# EAGLE board analog-io-breakout (EAGLE 8.3.2)
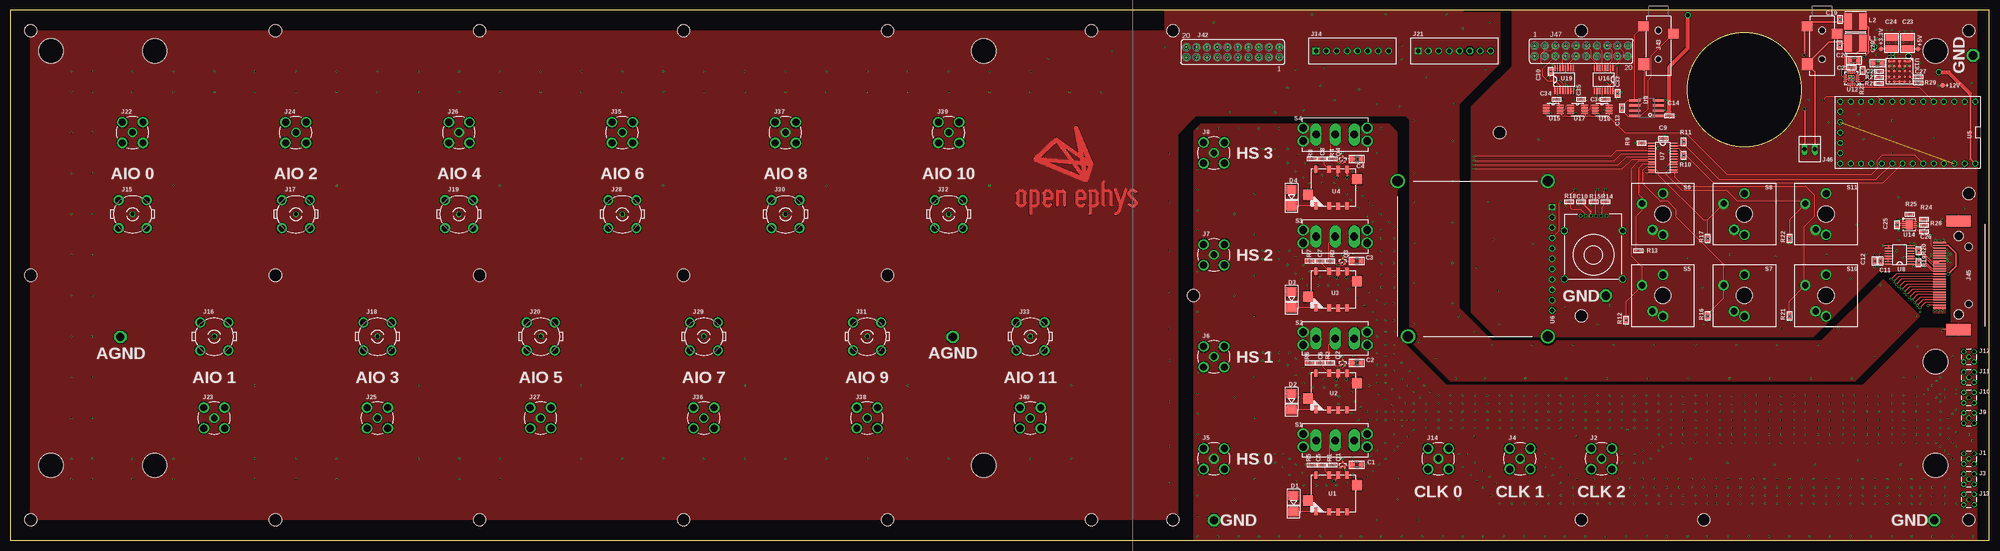
[diagram p5: board, top side]
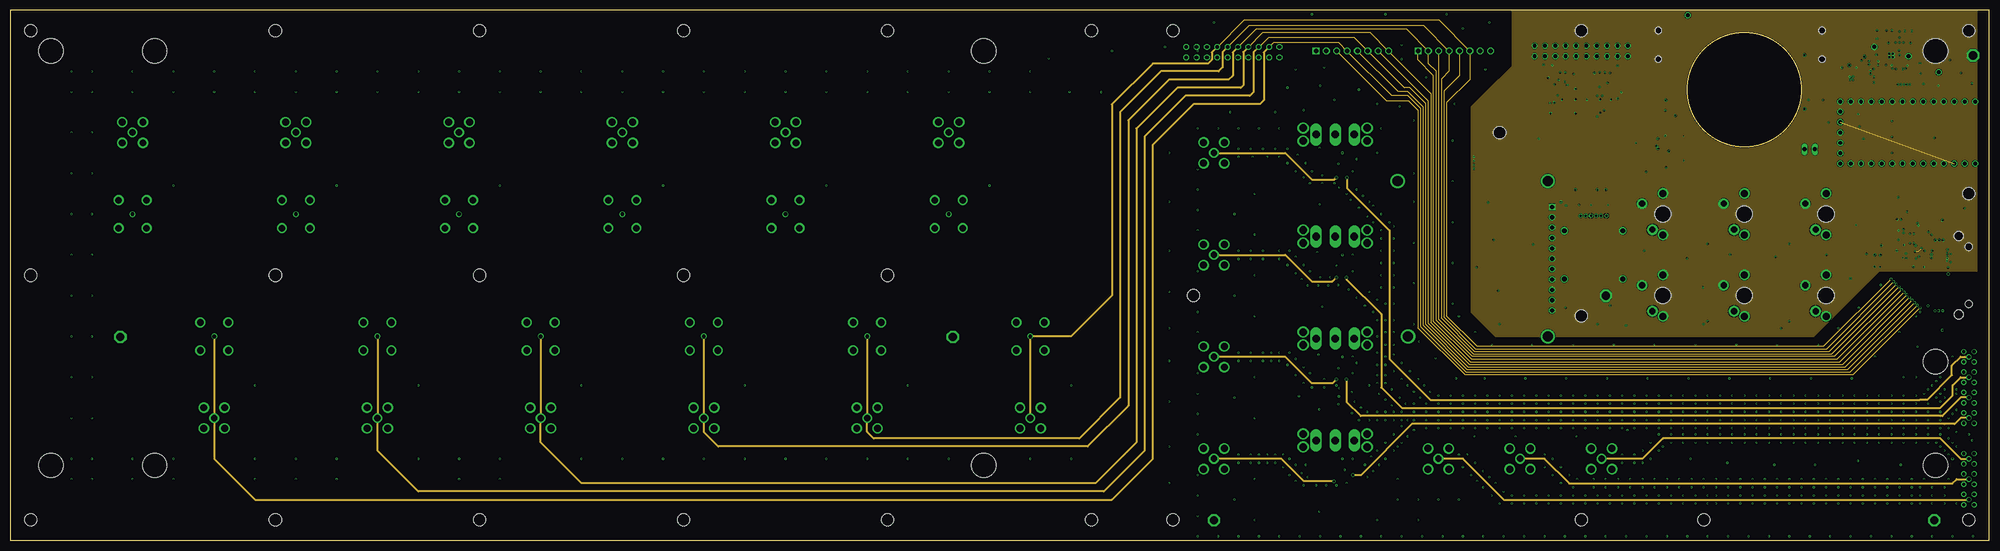
[diagram p6: board, inner layer Route2]
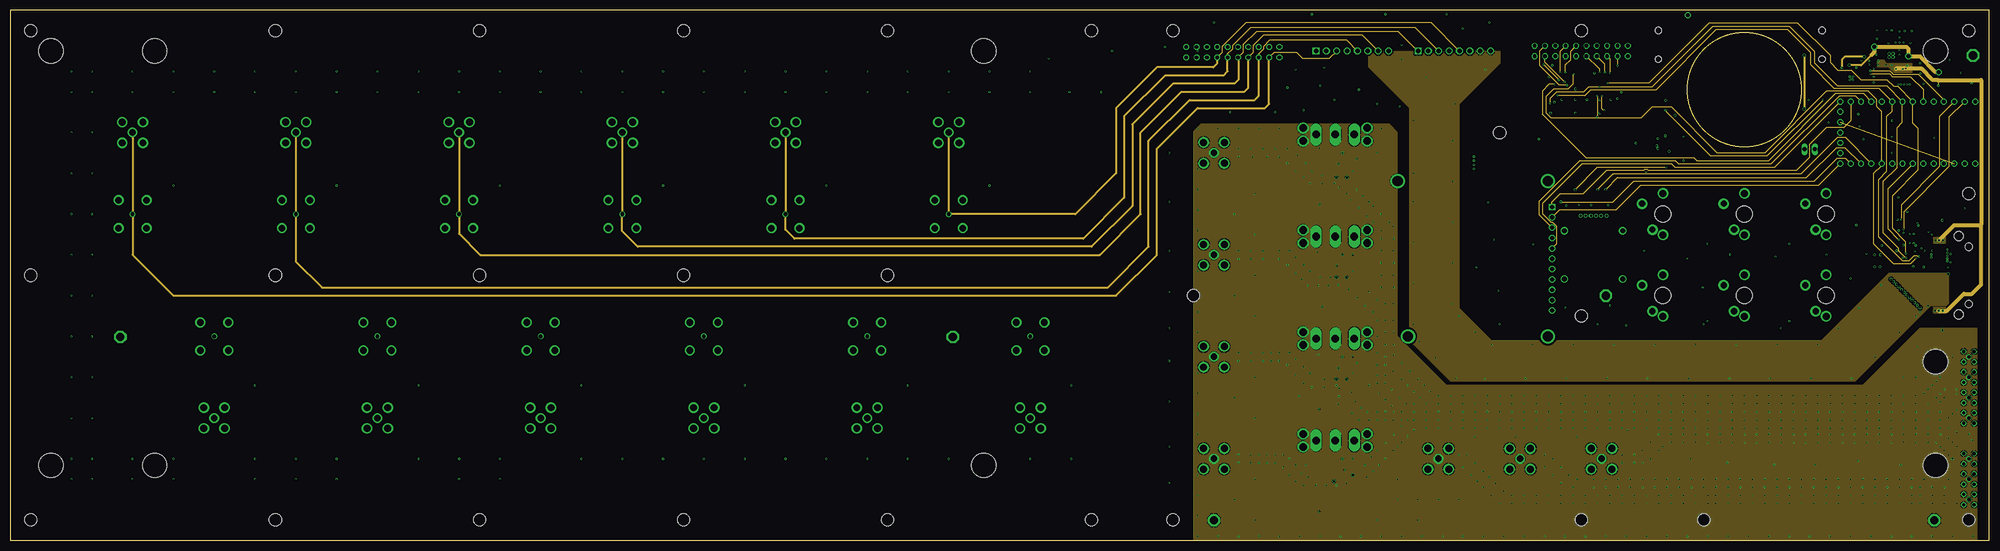
[diagram p7: board, inner layer Route15]
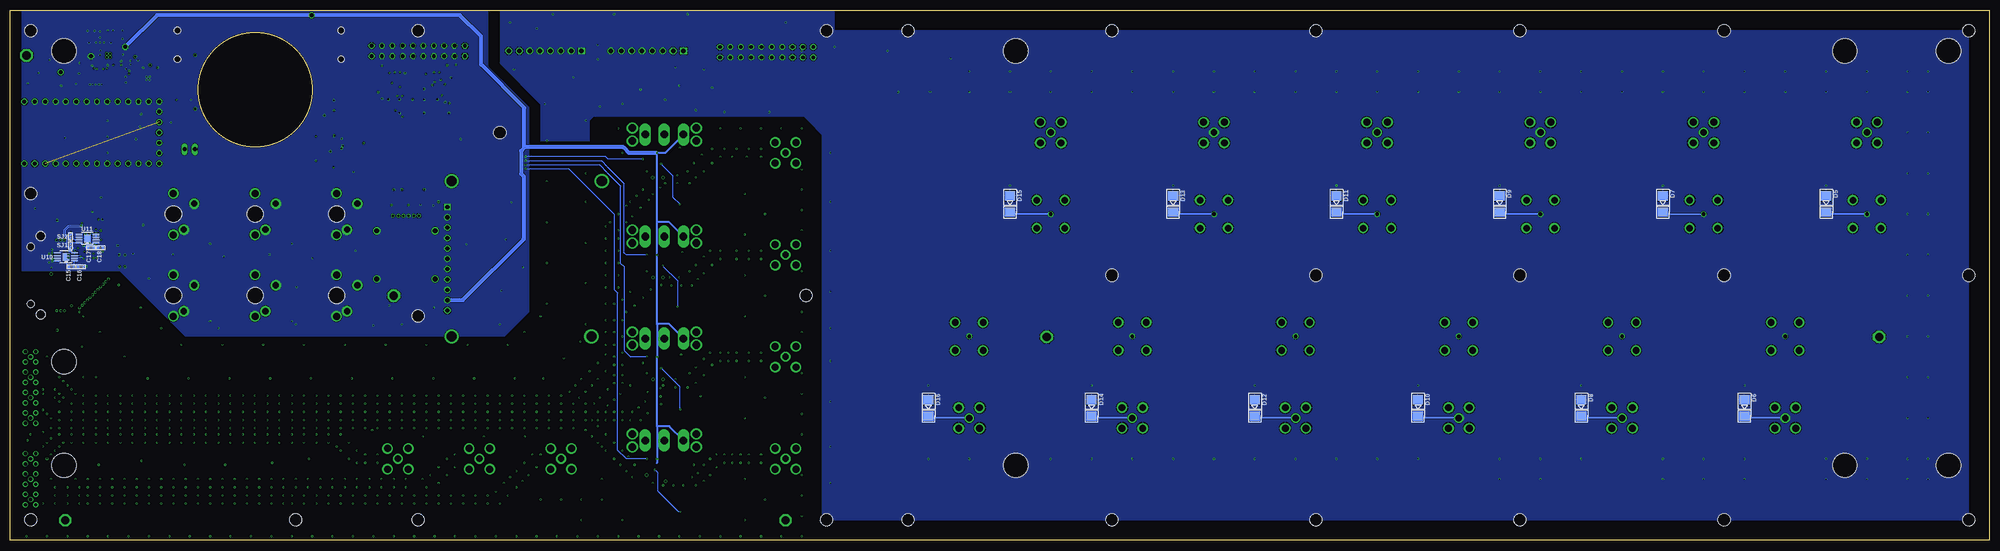
[diagram p8: board, bottom side, seen from below]

Size 485 x 130 mm. Coordinates in mm from the lower left corner, seen from the top.
Outline: 485,0 485,130 0,130 0,0 485,0
Outline: circle at 425,110.5 radius 14
Copper layers (1+2*15+16): Top 0.035mm / dielectric 0.2mm / Route2 0.0175mm / dielectric 1.065mm / Route15 0.0175mm / dielectric 0.2mm / Bottom 0.035mm
Design rules "jlcpcb-4-layer_JLC7628-stackup": minimum track width 3.5mil, minimum drill 0.2mm, track to track 3.5mil, track to pad 5mil, pad to pad 5mil, via to via 5mil, smd to smd 0mil, copper to edge 0.1mm, drill to drill 5mil, minimum pad ring 4mil, minimum via ring 4mil, stop-mask expansion 3mil, vias tented up to drill 100mil, thermal gap 10mil
Net classes: 1 stripline: width 0.48 mm, drill 0.5 mm, clearance 0.1 mm; 3 100 Ohm Diff Mid: width 0.2 mm, drill 0.2 mm, clearance 0.09 mm
Holes 3 mm at 5,125 5,5 480,125 480,5 265,125 285,125 285,5 265,5 215,5 165,5 115,5 65,5 65,125 115,125 165,125 215,125 65,65 115,65 165,65 215,65 5,65 480,85 290,60 385,125 385,5 365,100 415,5 385,55
Holes 6 mm at 10,120 238.6,120 238.6,18.4 10,18.4 471.8,18.4 35.4,120 35.4,18.4 471.8,43.8 471.8,120
tRestrict: 4 lines

## Footprints (pad centres in the part's own frame; a part is rotated, then mirrored left to right if it is on the bottom)
0805 = smd 0.965 x 1.524: 1 -1.041,0; 2 1.041,0
0402 = smd 0.686 x 0.762: 1 -0.533,0; 2 0.533,0
1210 = smd 1.651 x 2.794: 1 -1.397,0; 2 1.397,0
SMA-DO214AC = smd 2.3 x 2.5: A -2,0; C 2,0
MMCX-THRU = drill 0.8: GND@1 -1.27,1.27; GND@2 -1.27,-1.27; GND@3 1.27,-1.27; GND@4 1.27,1.27; SIG 0,0
SMA_JACK_142-0701-201 = drill 1.575: CLK 0,0 | drill 1.702: GND$1 -2.54,2.54; GND$2 2.54,2.54; GND$3 -2.54,-2.54; GND$4 2.54,-2.54
0731010360 = drill 0.9: 1 0,0 | drill 1.6: 2 3.43,3.43; 3 -3.43,3.43; 4 -3.43,-3.43; 5 3.43,-3.43
SCREW8 = drill 1.1 square: 1 0,0 | drill 1.1 octagon: 2 2.54,0; 3 5.08,0; 4 7.62,0; 5 10.16,0; 6 12.7,0; 7 15.24,0; 8 17.78,0
FE10-2 = drill 0.914 octagon: 1 -11.43,1.27; 2 -11.43,-1.27; 3 -8.89,1.27; 4 -8.89,-1.27; 5 -6.35,1.27; 6 -6.35,-1.27; 7 -3.81,1.27; 8 -3.81,-1.27; 9 -1.27,1.27; 10 -1.27,-1.27; 11 1.27,1.27; 12 1.27,-1.27; 13 3.81,1.27; 14 3.81,-1.27; 15 6.35,1.27; 16 6.35,-1.27; 17 8.89,1.27; 18 8.89,-1.27; 19 11.43,1.27; 20 11.43,-1.27
35RASMT2BHNTRX = smd 2.4 x 2.55: 1 0.8,3.675; 5 -1.1,-3.675 | smd 2.9 x 2.75: 4 8.2,-3.575 | hole 1.6: 0,0; 7,0
12226-82X0-00XX = smd 0.335 x 3: 1 7.938,7.2; 2 6.668,7.2; 3 5.397,7.2; 4 4.128,7.2; 5 2.857,7.2; 6 1.587,7.2; 7 0.318,7.2; 8 -0.953,7.2; 9 -2.223,7.2; 10 -3.493,7.2; 11 -4.763,7.2; 12 -6.032,7.2; 13 -7.303,7.2; 14 7.303,7.2; 15 6.032,7.2; 16 4.763,7.2; 17 3.493,7.2; 18 2.223,7.2; 19 0.953,7.2; 20 -0.318,7.2; 21 -1.587,7.2; 22 -2.857,7.2; 23 -4.128,7.2; 24 -5.397,7.2; 25 -6.668,7.2; 26 -7.938,7.2 | smd 2.8 x 6: PAD1 -13.3,2.5; PAD2 13.3,2.5 | hole 1.8: 7,0; -7,0 | hole 2.3: 9.6,2.5; -9.6,2.5
22-23-2021 = drill 1 long: 1 -1.27,0; 2 1.27,0
2020 = smd 1.85 x 4.1: 1 -1.825,0; 2 1.825,0
SC75 = smd 0.356 x 0.503: 1 -0.508,-0.65; 2 0.508,-0.65; 3 0,0.65
CK_7101J1V3QE2 = drill 1.85 long: 1 0,0 | drill 1.85 pad 2.54 long: 2 0,4.7; 3 0,-4.7 | drill 1.85: P$4 -1.59,7.875; P$5 1.59,7.875; P$6 -1.59,-7.875; P$7 1.59,-7.875
CHERRY-MX = drill 1.714 pad 1.93: P$3 -5.08,0; P$4 5.08,0 | drill 1.5 pad 2.54: SW1 -3.81,2.54; SW2 2.54,5.08 | hole 4: 0,0
C14N32P-C3 = drill 0.6: 1 3.175,-9.6; 2 1.905,-9.6; 3 0.635,-9.6; 4 -0.635,-9.6; 5 -1.905,-9.6; 6 -3.175,-9.6 | drill 1.2: P$7 -7.15,-5.9; P$8 -7.15,5.9; P$9 7.15,5.9; P$10 7.15,-5.9
SJ_2_0201 = smd 0.432 x 0.432: 1 -0.559,0; 2 0.559,0; COM 0,0
TESTPOINT_2MM = drill 2 octagon: 1 0,0
B1,27 = smd 1.27 x 1.27: TP 0,0
TP12R = smd 1.2 x 1.2: TP 0,0
G6KU-2F-RF = smd 0.8 x 1.8: 1 0,-4.5; 1X6 5.4,4.5; 2 3.2,-4.5; 3 5.4,-4.6; 4 7.6,-4.5; 5 7.6,4.5; 6 3.2,4.5; 7 0,4.5 | smd 2.5 x 2.5: CASE1 -1.95,-1.75; CASE2 10.05,2.05
TEENSY_3.1_BASIC = drill 0.965: 0 -7.62,13.97; 1 -7.62,11.43; 2 -7.62,8.89; 3 -7.62,6.35; 3.3V 7.62,11.43; 3.3V1 -2.54,-16.51; 4 -7.62,3.81; 5 -7.62,1.27; 6 -7.62,-1.27; 7 -7.62,-3.81; 8 -7.62,-6.35; 9 -7.62,-8.89; 10 -7.62,-11.43; 11 -7.62,-13.97; 12 -7.62,-16.51; 13 7.62,-16.51; 14/A0 7.62,-13.97; 15/A1 7.62,-11.43; 16/A2 7.62,-8.89; 17/A3 7.62,-6.35; 18/A4 7.62,-3.81; 19/A5 7.62,-1.27; 20/A6 7.62,1.27; 21/A7 7.62,3.81; 22/A8 7.62,6.35; 23/A9 7.62,8.89; A14 5.08,-16.51; AGND 7.62,13.97; GND -7.62,16.51; GND1 0,-16.51; PGM 2.54,-16.51; VBAT -5.08,-16.51; VIN 7.62,16.51
ADAFRUIT_1_5_OLED = drill 1.016: 1X111 6.35,-37.846; 1X112 8.89,-37.846; 1X113 11.43,-37.846; 1X114 13.97,-37.846; 1X115 16.51,-37.846; 1X116 19.05,-37.846; 1X117 21.59,-37.846; 1X118 24.13,-37.846; 1X119 26.67,-37.846; 1X1110 29.21,-37.846 | drill 1.016 square: 1X1111 31.75,-37.846 | drill 2.5: P$1 0,-2.54; P$2 38.1,0; P$3 0,-36.83; P$4 38.1,-36.83
TSSOP-24 = smd 1.6 x 0.3: 1 -2.8,3.575; 2 -2.8,2.925; 3 -2.8,2.275; 4 -2.8,1.625; 5 -2.8,0.975; 6 -2.8,0.325; 7 -2.8,-0.325; 8 -2.8,-0.975; 9 -2.8,-1.625; 10 -2.8,-2.275; 11 -2.8,-2.925; 12 -2.8,-3.575; 13 2.8,-3.575; 14 2.8,-2.925; 15 2.8,-2.275; 16 2.8,-1.625; 17 2.8,-0.975; 18 2.8,-0.325; 19 2.8,0.325; 20 2.8,0.975; 21 2.8,1.625; 22 2.8,2.275; 23 2.8,2.925; 24 2.8,3.575
TSSOP-16 = smd 1.6 x 0.3: 1 -2.8,2.275; 2 -2.8,1.625; 3 -2.8,0.975; 4 -2.8,0.325; 5 -2.8,-0.325; 6 -2.8,-0.975; 7 -2.8,-1.625; 8 -2.8,-2.275; 9 2.8,-2.275; 10 2.8,-1.625; 11 2.8,-0.975; 12 2.8,-0.325; 13 2.8,0.325; 14 2.8,0.975; 15 2.8,1.625; 16 2.8,2.275
SO-08 = smd 0.6 x 2.708: 1 -1.905,-2.854; 2 -0.635,-2.854; 3 0.635,-2.854; 4 1.905,-2.854; 5 1.905,2.854; 6 0.635,2.854; 7 -0.635,2.854; 8 -1.905,2.854
MSOP-8-PAD-3X3 = smd 1.6 x 0.4: 1 -2.1,0.975; 2 -2.1,0.325; 3 -2.1,-0.325; 4 -2.1,-0.975; 5 2.1,-0.325; 6 2.1,-0.975; 7 2.1,0.325; 8 2.1,0.975 | smd 1.57 x 1.89: PAD 0,0
QFN16_3MM = smd 0.8 x 0.28: 1 -1.5,0.75; 2 -1.5,0.25; 3 -1.5,-0.25; 4 -1.5,-0.75; 9 1.5,-0.75; 10 1.5,-0.25; 11 1.5,0.25; 12 1.5,0.75 | smd 0.28 x 0.8: 5 -0.75,-1.5; 6 -0.25,-1.5; 7 0.25,-1.5; 8 0.75,-1.5; 13 0.75,1.5; 14 0.25,1.5; 15 -0.25,1.5; 16 -0.75,1.5 | smd 1.5 x 1.5: THERMAL 0,0
BGA_5X5_625X625 = smd 0.635 x 0.635: A1 -2.54,2.54; A2 -1.27,2.54; A3 0,2.54; A4 1.27,2.54; A5 2.54,2.54; B1 -2.54,1.27; B2 -1.27,1.27; B3 0,1.27; B4 1.27,1.27; B5 2.54,1.27; C1 -2.54,0; C2 -1.27,0; C3 0,0; C4 1.27,0; C5 2.54,0; D1 -2.54,-1.27; D2 -1.27,-1.27; D3 0,-1.27; D4 1.27,-1.27; D5 2.54,-1.27; E1 -2.54,-2.54; E2 -1.27,-2.54; E3 0,-2.54; E4 1.27,-2.54; E5 2.54,-2.54
DFN83X3 = smd 0.7 x 0.25: 1 -1.4,0.75; 2 -1.4,0.25; 3 -1.4,-0.25; 4 -1.4,-0.75; 5 1.4,-0.75; 6 1.4,-0.25; 7 1.4,0.25; 8 1.4,0.75 | smd 1.65 x 2.38: PAD 0,0
VSSOP-N8-3X3 = smd 1.6 x 0.4: 1 -1.7,0.975; 2 -1.7,0.325; 3 -1.7,-0.325; 4 -1.7,-0.975; 5 1.7,-0.325; 6 1.7,-0.975; 7 1.7,0.325; 8 1.7,0.975

## Placement (x,y rotation side)
C1  10uF  [0805]  330,18.5 180 top
C2  10uF  [0805]  330,43.5 180 top
C3  10uF  [0805]  330,68.5 180 top
C4  10uF  [0805]  330,93.5 180 top
C5  47nF  [0402]  321.5,18.5 0 top
C6  47nF  [0402]  321,43.5 0 top
C7  47nF  [0402]  321,68.5 0 top
C8  47nF  [0402]  321.5,93.5 0 top
C9  0.1uF  [0402]  405.1,98.5 0 top
C10  0.1uF  [0402]  385,83 0 top
C11  1nF  [0402]  458.3,68.5 90 top
C12  0.1uF  [0402]  456.9,68.5 90 top
C13  0.1uF  [0402]  395,106 90 top
C14  0.1uF  [0402]  406.6,104.1 180 top
C15  1nF  [0402]  470,67.1 180 bottom
C16  0.1uF  [0402]  467.7,67.1 0 bottom
C17  1nF  [0402]  465.2,71.7 180 bottom
C18  0.1uF  [0402]  462.9,71.7 0 bottom
C19  220pF, NP0  [0402]  448.4,127.7 90 top
C20  10uF  [0805]  451.8,117.7 0 top
C21  0.1uF  [0402]  451.2,115.9 0 top
C22  220pF, NP0  [0402]  448.3,121.4 270 top
C23  47uF  [1210]  465,122 270 top
C24  47uF  [1210]  461,122 270 top
C25  0.1uF  [0402]  462.4,77.4 90 top
C26  4.7nF  [0402]  469,75.7 0 top
C27  0.1uF  [0402]  467.6,113.6 180 top
C28  0.1uF  [0402]  458,115 0 top
C29  10uF  [0805]  457.6,117 0 top
C30  0.1uF  [0402]  377.5,115 90 top
C33  0.1uF  [0402]  393.9,109.6 90 top
C34  0.1uF  [0402]  379,108.1 0 top
C35  0.1uF  [0402]  385,108.1 0 top
C36  0.1uF  [0402]  390.9,108.1 0 top
D1  S1GTR  [SMA-DO214AC]  314.5,9 270 top
D2  S1GTR  [SMA-DO214AC]  314,34 270 top
D3  S1GTR  [SMA-DO214AC]  314,59 270 top
D4  S1GTR  [SMA-DO214AC]  314,84 270 top
D5  P6SMB18CA  [SMA-DO214AC]  40,82.5 270 bottom
D6  P6SMB18CA  [SMA-DO214AC]  60,32.5 270 bottom
D7  P6SMB18CA  [SMA-DO214AC]  80,82.5 270 bottom
D8  P6SMB18CA  [SMA-DO214AC]  100,32.5 270 bottom
D9  P6SMB18CA  [SMA-DO214AC]  120,82.5 270 bottom
D10  P6SMB18CA  [SMA-DO214AC]  140,32.5 270 bottom
D11  P6SMB18CA  [SMA-DO214AC]  160,82.5 270 bottom
D12  P6SMB18CA  [SMA-DO214AC]  180,32.5 270 bottom
D13  P6SMB18CA  [SMA-DO214AC]  200,82.5 270 bottom
D14  P6SMB18CA  [SMA-DO214AC]  220,32.5 270 bottom
D15  P6SMB18CA  [SMA-DO214AC]  240,82.5 270 bottom
D16  P6SMB18CA  [SMA-DO214AC]  260,32.5 270 bottom
J1  [MMCX-THRU]  480,20 0 top
J2  [SMA_JACK_142-0701-201]  390,20 0 top
J3  [MMCX-THRU]  480,15 0 top
J4  [SMA_JACK_142-0701-201]  370,20 0 top
J5  [SMA_JACK_142-0701-201]  295,20 0 top
J6  [SMA_JACK_142-0701-201]  295,45 0 top
J7  [SMA_JACK_142-0701-201]  295,70 0 top
J8  [SMA_JACK_142-0701-201]  295,95 0 top
J9  [MMCX-THRU]  480,30 0 top
J10  [MMCX-THRU]  480,35 0 top
J11  [MMCX-THRU]  480,40 0 top
J12  [MMCX-THRU]  480,45 0 top
J13  [MMCX-THRU]  480,10 0 top
J14  [SMA_JACK_142-0701-201]  350,20 0 top
J15  [0731010360]  30,80 0 top
J16  [0731010360]  50,50 0 top
J17  [0731010360]  70,80 0 top
J18  [0731010360]  90,50 0 top
J19  [0731010360]  110,80 0 top
J20  [0731010360]  130,50 0 top
J21  SCREW8  [SCREW8]  345,120 0 top
J22  [SMA_JACK_142-0701-201]  30,100 0 top
J23  [SMA_JACK_142-0701-201]  50,30 0 top
J24  [SMA_JACK_142-0701-201]  70,100 0 top
J25  [SMA_JACK_142-0701-201]  90,30 0 top
J26  [SMA_JACK_142-0701-201]  110,100 0 top
J27  [SMA_JACK_142-0701-201]  130,30 0 top
J28  [0731010360]  150,80 0 top
J29  [0731010360]  170,50 0 top
J30  [0731010360]  190,80 0 top
J31  [0731010360]  210,50 0 top
J32  [0731010360]  230,80 0 top
J33  [0731010360]  250,50 0 top
J34  SCREW8  [SCREW8]  320,120 0 top
J35  [SMA_JACK_142-0701-201]  150,100 0 top
J36  [SMA_JACK_142-0701-201]  170,30 0 top
J37  [SMA_JACK_142-0701-201]  190,100 0 top
J38  [SMA_JACK_142-0701-201]  210,30 0 top
J39  [SMA_JACK_142-0701-201]  230,100 0 top
J40  [SMA_JACK_142-0701-201]  250,30 0 top
J42  [FE10-2]  299.62,119.69 180 top
J43  SJ1-3514-SMT-TR  [35RASMT2BHNTRX]  403.9,125 270 top
J44  SJ1-3514-SMT-TR  [35RASMT2BHNTRX]  444,125 270 top
J45  12226-8250-00FR  [12226-82X0-00XX]  480,65 90 top
J46  22-23-2021  [22-23-2021]  441,95.9 0 top
J47  [FE10-2]  385,120 0 top
L1  NFZ5BBW520LN10L  [2020]  452.2,121.9 0 top
L2  NFZ5BBW520LN10L  [2020]  452.2,127.2 0 top
Q1  SI1012R  [SC75]  326.5,18.5 0 top
Q2  SI1012R  [SC75]  326.5,43.5 0 top
Q3  SI1012R  [SC75]  326.5,68.5 0 top
Q4  SI1012R  [SC75]  326.5,93.5 0 top
R1  1k  [0402]  324,18.5 0 top
R2  1k  [0402]  323.5,43.5 180 top
R3  1k  [0402]  323.5,68.5 180 top
R4  1k  [0402]  324,93.5 180 top
R5  49.9  [0402]  319,18.5 180 top
R6  49.9  [0402]  318.5,43.5 180 top
R7  49.9  [0402]  318.5,68.5 180 top
R8  49.9  [0402]  319,93.5 180 top
R9  10k  [0402]  399.8,97.4 0 top
R10  10k  [0402]  410.1,94.4 90 top
R11  10k  [0402]  410.1,97.7 270 top
R12  1k  [0402]  396,54 270 top
R13  1k  [0402]  399,71 0 top
R14  1k  [0402]  391,83 0 top
R15  1k  [0402]  388,83 180 top
R16  1k  [0402]  416,55 270 top
R17  1k  [0402]  416,74 270 top
R18  1k  [0402]  382,83 0 top
R19  100  [0402]  467.7,68.1 90 top
R20  100  [0402]  467.7,71 90 top
R21  1k  [0402]  436,55 270 top
R22  1k  [0402]  436,74 270 top
R23  1M  [0402]  453.9,115.2 90 top
R24  60 1%  [0402]  469,78.7 180 top
R25  3k  [0402]  465.5,79.9 0 top
R26  60 1%  [0402]  469,77.2 180 top
R27  13.3k  [0402]  458,113.5 180 top
R28  649k  [0402]  458,112 180 top
R29  8.25k  [0402]  467.6,112.2 0 top
S1  [CK_7101J1V3QE2]  324.7,24.5 270 top
S2  [CK_7101J1V3QE2]  324.7,49.5 270 top
S3  [CK_7101J1V3QE2]  324.7,74.5 270 top
S4  [CK_7101J1V3QE2]  324.7,99.5 270 top
S5  CHERRY-MX  [CHERRY-MX]  405,60 90 top
S6  CHERRY-MX  [CHERRY-MX]  405,80 90 top
S7  CHERRY-MX  [CHERRY-MX]  425,60 90 top
S8  CHERRY-MX  [CHERRY-MX]  425,80 90 top
S9  C14N32P-C3  [C14N32P-C3]  388,70 180 top
S10  CHERRY-MX  [CHERRY-MX]  445,60 90 top
S11  CHERRY-MX  [CHERRY-MX]  445,80 90 top
SJ1  [SJ_2_0201]  470.2,72.3 270 bottom
SJ2  [SJ_2_0201]  470.2,74.5 270 bottom
TP1  [TESTPOINT_2MM]  391,60 90 top
TP2  [B1,27]  458.5,120.5 270 top
TP3  [B1,27]  467.5,120.5 270 top
TP4  [TESTPOINT_2MM]  295,4.9 0 top
TP5  [TESTPOINT_2MM]  471.5,4.9 0 top
TP6  [TESTPOINT_2MM]  481,118.9 0 top
TP7  [TESTPOINT_2MM]  27,49.9 0 top
TP8  [TESTPOINT_2MM]  231,49.9 0 top
TP9  [TP12R]  473.5,111.5 0 top
U1  G6K-2F-RF  [G6KU-2F-RF]  320,11.5 0 top
U2  G6K-2F-RF  [G6KU-2F-RF]  320,36.5 0 top
U3  G6K-2F-RF  [G6KU-2F-RF]  320,61.5 0 top
U4  G6K-2F-RF  [G6KU-2F-RF]  320,86.5 0 top
U5  TEENSY_3.1_BASIC  [TEENSY_3.1_BASIC]  465,100 270 top
U6  ADAFRUIT_1_5_OLED  [ADAFRUIT_1_5_OLED]  340,50 90 top
U7  TCA9555  [TSSOP-24]  405,93.8 0 top
U8  FIN1032MTCX  [TSSOP-16]  463,70 180 top
U9  SI8610  [SO-08]  401,106 90 top
U10  SN65LVDS9638DGN  [MSOP-8-PAD-3X3]  471.3,69.5 180 bottom
U11  SN65LVDS9638DGN  [MSOP-8-PAD-3X3]  466.1,74 180 bottom
U12  MAX98357A  [QFN16_3MM]  451.2,113.3 180 top
U13  LTM4622A  [BGA_5X5_625X625]  463,115 270 top
U14  LTC2875_DFN  [DFN83X3]  465.4,77.4 0 top
U15  SN74LVC1G74DCUR  [VSSOP-N8-3X3]  378.1,105.7 0 top
U16  SN74HC595DWR  [TSSOP-16]  390.5,113 270 top
U17  SN74LVC1G74DCUR  [VSSOP-N8-3X3]  384.1,105.7 0 top
U18  SN74LVC1G74DCUR  [VSSOP-N8-3X3]  390.1,105.7 0 top
U19  SN74HC165PWR  [TSSOP-16]  380.8,113 90 top
X  OE-LOGO_28X20  [OE-LOGO-28X20]  260,87.5 0 top

## Tracks (layer width: path | path; a pad name or v marks a point on that pad's centre or on a via)
3.3V  (1 unrouted)
!SR_CLR  (via drill 0.2)
  Top 0.2: 391.8,103.9 v388.9,103.9 385.9,103.9 | U18.6 391.8,103.9 | 385.9,103.9 380.62,103.9 U15.6 | U17.6 385.9,104.72 385.9,103.9 | U16.10 388.88,109 v388.9,109 | 391.8,103.9 395.7,100 410.5,100 420.7,89.8 456.2,89.8 457.4,91 457.4,93.1 458.6,94.3 466.89,94.3 U5.21/A7
  Route15 0.2: v388.9,109 v388.9,103.9
+3V3  (via drill 0.2, 0.3, 0.35, 0.5)
  Top 0.152: U14.3 462.68,77.15 462.47,76.93
  Top 0.2: R9.1 v398.4,97.4 | C9.2 405.6,98.53 v405.6,99.2 | 462.47,76.93 C25.1 | R11.1 v410.1,99.1 | R10.1 v410.1,93.1 | 387.37,82.9 R15.2 387.4,82.93 v387.4,82.2 | R14.2 391.6,82.93 v391.6,82.2 | v463.8,69.3 464.18,69.67 U8.4
  Top 0.3: U8.16 458.54,67.72 C11.1 | C11.1 C12.1 v456.9,67.1 | C11.1 458.2,67.87 v458.2,67.1 | C9.2 406.76,97.38 U7.24 | C25.1 462.4,76.4 v462.8,76 | v380.3,108.1 C34.2 379.53,106.94 U15.8 U15.7 | U17.7 U17.8 385.53,106.94 C35.2 v386.4,108.1 | U18.7 U18.8 391.43,107.04 C36.2 v392.3,108.1 | U16.16 393.83,110.2 C33.2 394.57,110.13 v394.8,109.9 | v377.9,116.5 377.9,115.53 | 377.9,115.53 C30.2 | 377.9,115.53 378.52,115.53 U19.16
  Top 0.5: C24.2 460.9,120.5 TP2.TP | S9.3 387.37,80.6 385.53,82.43 C10.2
  Top 0.508: U13.E1 U13.D1
  Bottom 0.3: 464,71.7 C18.1 | 464,71.7 C17.1 | 464,71.7 v464,72.4 U11.1 | U10.1 469.4,68.33 469.4,67.1 C15.1 469.37,67 v468.9,67 468.33,67 C16.1
  other vias: 460.5,119.3 461.4,119.3 460.5,118.5 461.4,118.5
  pour Route2: 368,132 368,116.2 361.8,110 358,106.2 358,56 364,50 442,50 458,66 482,66 482,132
  pour Top (rank 2, no thermals): 460,121 460,117 462,117 462,121
+5V0  (via drill 0.3, 0.3 pad 0.55, 0.5, 1)
  Top 0.2: U12.8 450.7,114.8 U12.7 | U9.1 405.94,104.09 405.95,104.1 C14.2 | C20.1 450.9,117.7 451.9,116.7 452.83,116.7 453.8,115.73 R23.2
  Top 0.3: Q3.3 v326.5,70 | Q2.3 v326.5,45 | Q1.3 v326.5,20 | Q4.3 v326.5,95 | C14.2 406.07,104.69
  Top 0.5: 480.3,109.5 480.3,93.59 U5.VIN | C23.2 465.1,120.5 TP3.TP | 405.95,104.09 U9.1 | C20.1 450.67,117.61 v450.67,116.5 C21.1 450.7,115.87 450.7,114.8
  Top 0.508: U13.B1 U13.A1
  Top 1: 480.3,109.5 475,114.8 v472.6,114.8 | 406.07,104.69 406.6,105.23 406.6,116.2 411.1,120.7 v411.1,128.8
  Route15 0.5: 456.09,119.01 453.58,116.5 v450.67,116.5
  Route15 1: v472.6,114.8 471.8,114.8 467.9,118.7 v465.2,118.7 465.2,120.5 464.7,121 v456.8,121 456.8,119.72 456.09,119.01
  Bottom 0.5: v326.5,95 326.5,95.1 326.6,95.2 326.8,95 v326.5,95 | 326.5,78 v326.5,70 326.5,53 | 326.5,53 v326.5,45 326.5,28 | 326.5,28 v326.5,20 326.5,19 | S3.3 323.5,78 326.5,78 | S2.3 323.5,53 326.5,53 | S4.3 324.5,95 v326.5,95 | S1.3 323.5,28 326.5,28 | 326.5,78 v326.5,95
  Bottom 1: 358.9,96.4 334.7,96.4 333.3,95 326.8,95 | v456.8,121 449,128.8 v411.1,128.8 374.8,128.8 369.65,123.65 369.65,116.75 359,106.1 359,96.5 358.9,96.4 | U6.1X112 374.11,58.89 359.2,73.8 359.2,89.27 359.83,89.9 359.83,95.47 358.9,96.4
  pour Top (rank 2, no thermals): 464,117 464,121 466,121 466,117
+12V  (via drill 0.2, 0.35)
  Top 0.2: 472.86,73 J45.1 | v472.5,111.5 TP9.TP
  Route15 0.2: 472.3,112.85 472.5,112.85 v472.5,111.5
  Route15 1: v472.6,56.3 474.63,56.3 478.75,60.42 480.72,60.42 483,62.7 483,77.4 | v472.7,73.6 472.73,73.6 476.4,77.27 482.87,77.27 483,77.4 | 483,77.4 483,112.85 472.3,112.85 471.15,112.85 468.4,115.6 v462.1,115.6
  other vias: 471.7,56.3 473.6,56.3 473.7,73.6 471.8,73.6 461.3,115.7 461.1,116.5 459.7,116.6 464.5,115.7 464.9,116.4 457.8,117.5 457.8,116.6 463.8,115.6
  pour Top (rank 2, no thermals): 471.3,57.1 471.3,55.8 474.3,55.8 474.3,57.1
  pour Route15 (rank 2, no thermals): 471.3,57.1 471.3,55.8 474.3,55.8 474.3,57.1
  pour Top (no thermals): 471.3,74.2 471.3,72.9 474.3,72.9 474.3,74.2
  pour Route15 (no thermals): 471.3,74.2 471.3,72.9 474.3,72.9 474.3,74.2
  pour Top (no thermals): 457.6,116.2 460.2,116.2 461.6,114.8 462.4,114.8 462.4,116.9 459.9,116.9 459.1,117.7 459.1,117.8 457.6,117.8
  pour Top (no thermals): 463.6,114.8 463.6,116.8 466.1,116.8 466.1,116 465.8,116 464.6,114.8
  pour Route15 (no thermals): 457.6,116.2 460.2,116.2 461.6,114.8 466.1,114.8 466.1,116.9 459.9,116.9 459.1,117.7 459.1,117.8 457.6,117.8
AGND  (via drill 0.2, 0.35, 0.5)
  Top 0.3: J45.14 474.5,72.3 474.7,72.3 | J45.13 470.2,57.7 v470,57.5
  Top 0.5: v474.9,65.3 476.9,67.3 476.9,70.3 474.9,72.3 474.5,72.3
  other vias: 443,48 40,110 30,110 50,110 70,110 60,110 80,110 100,110 90,110 110,110 130,110 120,110 140,110 160,110 150,110 170,110 190,110 180,110 20,30 20,20 20,40 20,60 20,50 20,70 20,90 20,80 20,100 60,20 70,20 80,20 100,20 110,20 120,20 140,20 150,20 160,20 30,20 40,20 170,20 180,20 190,20 200,20 210,20 220,20 230,20 250,20 260,20 200,110 210,110 220,110 230,110 240,110 250,110 267.4,109.9 270,120 259.6,110 60,38 100,38 140,38 180,38 220,38 260,38 240,87 200,87 160,87 120,87 80,87 40,87 30,15 40,15 60,15 70,15 80,15 110,15 120,15 20,15 15,110 15,30 15,20 15,40 15,60 15,50 15,70 15,90 15,80 15,100 15,15 15,115 20,115 40,115 30,115 50,115 70,115 60,115 80,115 100,115 90,115 110,115 130,115 120,115 140,115 160,115 150,115 170,115 190,115 180,115 200,115 210,115 220,115 230,115 240,115 250,115 254.5,118.2 433,48 423,48 413,48 403,48 393,48 383,48 373,48 363,48 451.3,39.7 441.3,39.7 431.3,39.7 421.3,39.7 411.3,39.7 401.3,39.7 391.3,39.7 381.3,39.7 371.3,39.7 361.3,39.7 354.3,39.7 349.3,44.7 345.3,48.7 343.9,53 359,51 355,55 353.5,58 343.9,63 343.9,73 343.9,83 343.9,90 343.9,103 353.5,68 353.5,78 353.5,88 353.5,98 354,107 361.5,115.5 322,116 340.5,106.4 335,107 313,111 310,105 299,105 284,95 284,83 284,71 284,61 284,52 284,44 284,34 284,23 284,14 283,121 448,52 453,57 457,45 463,51 468,56 341,118 319,129 337,129 352,129 295,127 291,120 20,110 458.4,62.6 467,55 321,111.5 315,115.5 324.5,108 317,105.5 330.5,110.5 341,121.5 347,113.5 362.5,127 356,125.5
  pour Top (rank 2): 5,125 286,125 286,5 5,5
  pour Top (isolate 0.4): 459,64 468,55 452,39 353,39 343,49 343,106 333,116 333,133 365,133 365,117 355,107 355,57 363,49 444,49
  pour Top: 343,103 342,104 290.5,104 284.9,98.4 283,104 283,133 356,133 356,117.3 343,117.3
  pour Bottom: 5,125 286,125 286,5 5,5
  pour Route15 (isolate 0.4): 444,49 460.5,65.5 475,65.5 475,57.5 470.5,57.5 452,39 353,39 343,49 343,106 333,116 333,120 365,120 365,117 355,107 355,57 363,49
  pour Bottom: 343,98 343,103 342,104 290.5,104 284.9,98.4 283,104 283,133 365,133 365,117 355,107 355,98
AIO_0  (via drill 0.35)
  Top 0.2: v468,57 469.33,58.33 J45.25
  Route2 0.2: v468,57 451.51,40.52 356.61,40.52 345.01,52.11 345.01,105.48 342.7,107.8 337.28,107.8 J34.3
  Route15 0.2: J42.3 309.69,119.6 315.29,119.6 316.8,118.1 323.18,118.1 J34.3
  Route15 0.5: J22.CLK J15.1 30,70 40,60 271,60 281,70 281,96 291,106 307.51,106 308.51,107 J42.3
  Bottom 0.5: J22.CLK 30.07,100.07 | J15.1 40,80 D5.C
AIO_1  (via drill 0.35)
  Top 0.2: v467.36,57.64 468.68,58.97 J45.12
  Route2 0.2: v467.36,57.64 450.87,41.15 356.87,41.15 345.65,52.37 345.65,105.85 342.5,109 338.62,109 J34.4 325.52,122.1 309.65,122.1 J42.4
  Route2 0.5: J16.1 J23.CLK 50,20 60,10 270,10 280,20 280,97 290,107 306.2,107 307.2,108 307.2,119.65 J42.4
  Bottom 0.5: 50.07,29.93 J23.CLK 60,30 D6.C
AIO_2  (via drill 0.35)
  Top 0.2: v466.71,58.28 468.03,59.6 J45.24
  Route2 0.2: v466.71,58.28 450.21,41.78 357.13,41.78 346.28,52.63 346.28,106.22 342.5,110 340.16,110 J34.5
  Route15 0.2: J42.5 305.97,119.27 307.2,120.5 307.2,121.2 308.7,122.7 327.46,122.7 J34.5
  Route15 0.5: J24.CLK J17.1 70,68.4 76.4,62 269,62 279,72 279,98 289,108 304.97,108 305.97,109 J42.5
  Bottom 0.5: J17.1 80,80 D7.C
AIO_3  (via drill 0.35)
  Top 0.2: v466.07,58.93 467.38,60.24 J45.11
  Route2 0.2: v466.07,58.93 449.56,42.42 357.4,42.42 346.92,52.9 346.92,107.08 343,111 341.7,111 J34.6 329.3,123.4 308.41,123.4 J42.6
  Route2 0.5: J18.1 J25.CLK 90,22 100,12 268,12 278,22 278,99 288,109 303.8,109 304.7,109.9 304.7,119.69 J42.6
  Bottom 0.5: J25.CLK 100,30 D8.C
AIO_4  (via drill 0.35)
  Top 0.2: v465.43,59.57 466.73,60.87 J45.23
  Route2 0.2: v465.43,59.57 448.91,43.05 357.66,43.05 347.56,53.16 347.56,107.69 343.24,112 J34.7
  Route15 0.2: J42.7 304.7,119.69 304.7,121.4 307.3,124 331.24,124 J34.7
  Route15 0.5: J26.CLK J19.1 110,75.2 115.2,70 267,70 277,80 277,100 287,110 302.43,110 303.43,111 J42.7
  Bottom 0.5: J19.1 120,80 D9.C
AIO_5  (via drill 0.35)
  Top 0.2: v464.79,60.21 466.08,61.51 J45.10
  Route2 0.2: v464.79,60.21 448.18,43.61 358,43.61 348.19,53.42 348.19,109.59 J34.8 333.33,124.45 306.92,124.45 J42.8
  Route2 0.5: J20.1 J27.CLK 130,24 140,14 266,14 276,24 276,101 286,111 301.6,111 302.2,111.6 302.2,119.73 J42.8
  Bottom 0.5: J27.CLK 140,30 D10.C
AIO_6  (via drill 0.35)
  Top 0.2: v464.14,60.86 465.43,62.14 J45.22
  Route2 0.2: v464.14,60.86 447.61,44.33 358.19,44.33 348.82,53.69 348.82,114 345,117.83 J21.1
  Route15 0.2: J42.9 302.2,119.73 302.2,121.6 305.5,124.9 340.1,124.9 J21.1
  Route15 0.5: J35.CLK J28.1 150,75.8 153.8,72 265,72 275,82 275,102 285,112 300,112 301,113 301,118.42 J42.9
  Bottom 0.5: J28.1 160,80 D11.C
AIO_7  (via drill 0.35)
  Top 0.2: v463.5,61.5 464.78,62.78 J45.9
  Route2 0.2: v463.5,61.5 447.05,45.05 358.36,45.05 349.46,53.95 349.46,115 347.54,116.92 J21.2 342.25,125.29 305.22,125.29 J42.10 | J36.CLK 170,29.5
  Route2 0.5: J29.1 170,29.5 170,26.5 173.5,23 264,23 274,33 274,103 284,113 298.6,113 299.6,114 299.6,119.67 J42.10
  Bottom 0.5: J36.CLK 180,30 D12.C
AIO_8  (via drill 0.35)
  Top 0.2: v462.86,62.14 464.13,63.41 J45.21
  Route2 0.2: v462.86,62.14 446.31,45.59 358.71,45.59 350.1,54.21 350.1,120 J21.3
  Route15 0.2: J42.11 298.35,119.35 299.6,120.6 299.6,121.4 304,125.8 344.28,125.8 J21.3
  Route15 0.5: J37.CLK J30.1 190,76.2 192.2,74 263,74 273,84 273,104 283,114 297.35,114 298.35,115 J42.11
  Bottom 0.5: J30.1 200,80 D13.C
AIO_9  (via drill 0.35)
  Top 0.2: v462.22,62.78 463.48,64.05 J45.8
  Route2 0.2: v462.22,62.78 445.66,46.23 358.97,46.23 350.73,54.47 350.73,113.11 352.62,115 J21.4 346.36,126.26 303.65,126.26 J42.12
  Route2 0.5: J31.1 J38.CLK 210,26.6 211.6,25 262,25 272,35 272,105 282,115 296.1,115 297.1,116 297.1,119.71 J42.12
  Bottom 0.5: J38.CLK 220,30 D14.C
AIO_10  (via drill 0.35)
  Top 0.2: v461.57,63.43 462.83,64.68 J45.20
  Route2 0.2: v461.57,63.43 445.01,46.87 359.24,46.87 351.37,54.74 351.37,110.2 355.16,114 J21.5
  Route15 0.2: J42.13 297.1,119.71 297.1,121.2 302.9,127 348.16,127 J21.5
  Route15 0.5: J39.CLK J32.1 261,80 271,90 271,106 281,116 294.81,116 295.81,117 J42.13
  Bottom 0.5: J32.1 240,80 D15.C
AIO_11  (via drill 0.35)
  Top 0.2: v460.93,64.07 462.18,65.32 J45.7
  Route2 0.2: v460.93,64.07 444.36,47.5 359.5,47.5 352,55 352,107.3 357.7,113 J21.6 350.06,127.64 302.49,127.64 J42.14
  Route2 0.5: J40.CLK J33.1 260,50 270,60 270,106.9 280,116.9 293.5,116.9 294.5,117.9 294.5,119.65 J42.14
  Bottom 0.5: J40.CLK 260,30 D16.C
BCLK  (via drill 0.2)
  Top 0.2: U12.16 454.4,111.8 455.9,113.3 v455.9,114.4
  Route15 0.2: U5.4 468.81,110.59 465.65,113.75 461.25,113.75 460.6,114.4 v455.9,114.4
BUTTON1
  Top 0.2: R12.1 396,58.62 S5.SW2 399.92,67 397.12,69.8 397.12,91.04 398.9,92.83 U7.8
BUTTON2
  Top 0.2: R13.1 398.47,79.55 399.92,81 S6.SW2 399.92,84 399,84.92 399,91.17 400,92.17 U7.9
BUTTON3
  Top 0.2: R16.1 419.92,59.45 S7.SW2 419.92,67.67 408.11,79.48 408.11,81.29 406.29,83.11 404.48,83.11 400,87.59 400,90.62 400.9,91.53 U7.10
BUTTON4
  Top 0.2: R17.1 416,78.62 | 416,78.62 415.4,78.62 414.9,78.62 403.8,89.72 403.8,90.5 403.4,90.9 402.18,90.9 | 416,78.62 S8.SW2 | U7.11 402.18,90.9 | 401.9,90.9 402.18,90.9
BUTTON5
  Top 0.2: R21.1 436,58.62 439.69,62.31 | 439.69,62.31 439.69,77 442.2,79.51 442.2,84.6 439.9,86.9 413.2,86.9 413.1,86.9 410.1,86.9 407.8,89.2 U7.13 | S10.SW2 439.69,62.31
BUTTON6
  Top 0.2: 407.88,90.8 U7.14 406.48,90.88 405.9,90.3 405.9,89.7 409.9,85.7 420.81,85.7 423.4,83.11 439.35,83.11 S11.SW2 439.92,82.42 436,78.5 | 436,78.62 436,78.5 | 436,78.5 R22.1
CAN_N  (via drill 0.2)
  Top 0.2: R26.2 v467.6,77.2 467.55,77.15 U14.6
  Bottom 0.2: SJ1.2 470.74,71.74 471,72 471,73.9 471.7,74.6 471.7,76.2 470.6,77.3 467.7,77.3 v467.6,77.2 467.6,77.24
CAN_P  (via drill 0.2)
  Top 0.2: U14.7 467.35,77.65 v467.4,77.7 467.47,77.7 R24.2
  Bottom 0.2: SJ2.2 470.54,73.94 471.35,74.75 471.35,76.11 470.51,76.95 468.89,76.95 468.84,76.9 467.91,76.9 467.78,76.77 467.42,76.77 467.17,77.02 467.17,77.38 467.4,77.61 v467.4,77.7
CAN_RX  (via drill 0.2)
  Top 0.2: U14.4 v464,76.3
  Route15 0.2: U5.0 475.1,103.75 475.1,91.6 464,80.5 v464,76.3
CAN_TX  (via drill 0.2)
  Top 0.2: v463.4,78.75 U14.1
  Route15 0.2: U5.1 472.73,103.92 472.73,91.6 463.4,82.27 v463.4,78.75
CLK/8  (via drill 0.2)
  Top 0.2: U18.5 390.6,105.38 v390.6,105.4 | v390.1,109 390.18,109 U16.12
  Route15 0.2: v390.6,105.4 390.1,105.9 v390.1,109
DIN  (via drill 0.2)
  Top 0.2: U12.1 454.15,112.55 455.2,113.6 455.2,114.5 v455.85,115.15
  Route15 0.2: U5.2 473.89,108.01 467.6,114.3 461.5,114.3 460.65,115.15 v455.85,115.15
DIN0
  Top 0.2: U19.11 381.77,116.78 J47.10
DIN1  (via drill 0.2)
  Top 0.2: U19.12 381.12,114.72 v381.1,114.7
  Route15 0.2: v381.1,114.7 381.1,116.6 382.4,117.9 382.4,119.94 J47.9
DIN2
  Top 0.2: U19.13 380.48,118.02 J47.8
DIN3  (via drill 0.2)
  Top 0.2: U19.14 379.82,114.72 v379.8,114.7
  Route15 0.2: v379.8,114.7 379.9,114.8 379.9,119.98 J47.7
DIN4
  Top 0.2: U19.3 379.8,110.22 379.8,111.6 378.9,112.5 376.9,112.5 375.6,113.8 375.6,115.68 J47.6
DIN5  (via drill 0.2)
  Top 0.2: J47.5 377.38,120 375.9,120 375,119.1 375,117.4 375.77,116.63 v375.8,116.63 | v379.5,112.93 380.48,111.95 U19.4
  Route15 0.2: v375.8,116.63 v379.5,112.93
DIN6  (via drill 0.2)
  Top 0.2: U19.5 381.11,110.21 381.11,111.09 381,111.2 v381,112.4
  Route15 0.2: v381,112.4 376.11,117.29 J47.4
DIN7  (via drill 0.2)
  Top 0.2: U19.6 381.77,111.35 v381.5,111.63
  Route15 0.2: v381.5,111.63 379.67,111.63 374.9,116.4 374.9,120.06 J47.3
DOUT0  (via drill 0.2)
  Top 0.2: U16.15 392.12,111.72 393.9,113.5 v393.9,116.39
  Route15 0.2: J47.18 v393.9,116.39
DOUT1
  Top 0.2: J47.17 395.2,119.96 395.2,118.3 392.77,115.88 U16.1
DOUT2  (via drill 0.2)
  Top 0.2: U16.2 392.1,115.78 v392.1,114.6
  Route15 0.2: v392.1,114.6 392.1,117.98 J47.16
DOUT3
  Top 0.2: U16.3 391.48,116.67 392.6,117.8 392.6,120.02 J47.15
DOUT4  (via drill 0.2)
  Top 0.2: U16.4 390.8,115.78 v390.8,114.7
  Route15 0.2: v390.8,114.7 390.8,116.74 J47.14
DOUT5
  Top 0.2: U16.5 390.18,119.91 J47.13
DOUT6  (via drill 0.2)
  Top 0.2: U16.6 389.52,114.72 v389.5,114.7
  Route15 0.2: v389.5,114.7 389.5,115.5 J47.12
DOUT7
  Top 0.2: U16.7 388.88,116.83 387.5,118.2 387.5,120.04 J47.11
ENCODER_A  (via drill 0.35)
  Top 0.2: S9.5 389.9,81.4 390.47,81.96 R14.1 390.47,85.47 v391,86
  Route15 0.2: v391,86 393.9,88.9 440.2,88.9 447.5,96.2 449.75,96.2 U5.15/A1
ENCODER_B  (via drill 0.35)
  Top 0.2: S9.4 388.63,82.9 | 388.63,82.9 R15.1 | 388.63,82.9 388.63,85.64 v389,86
  Route15 0.2: 392.8,89.8 v389,86 | 392.8,89.8 392.85,89.85 | U5.16/A2 449.79,98.7 447.7,98.7 438.8,89.8 392.8,89.8
ENCODER_BUTTON  (via drill 0.2, 0.35)
  Top 0.2: S9.2 386.1,79.91 385,81 383,81 382.5,81.5 382.5,82.97 R18.2 382.53,85.03 v383.5,86 | v405.8,91.5 407.12,92.83 U7.17
  Route15 0.2: v405.8,91.5 389,91.5 v383.5,86
GND  (via drill 0.2, 0.3, 0.35)
  Top 0.152: U14.2 462.68,77.65 C25.2
  Top 0.2: J45.PAD1 473.7,51.7 v473.5,51.5 | U7.2 402.2,96.7 v403.5,96.7 | U14.PAD 464.87,77.93 | v403.8,98.5 C9.1 | U7.21 407.82,95.4 v406.5,95.4 | v403.8,96.1 402.23,96.1 U7.3 | U9.4 v405.7,107.9 | R12.2 v396,52.7 | R16.2 v416,53.7 | R21.2 v436,53.7 | R22.2 v436,72.7 | R17.2 v416,72.7 | R13.2 v400.4,71 | C26.2 v470.1,75.7 | v464.9,80.6 464.97,80.53 R25.1 | U8.12 461.18,70.33 461.4,70.1 461.4,69.2 461.23,69.03 U8.14 U8.15 | U12.THERMAL 451.45,113.3 U12.15 | U12.11 450.8,113.05 v450.8,112.9 | R18.1 381.3,82.83 v381.3,82.1 | C10.1 384.5,82.97 v384.5,82.3 | v456.7,113.6 456.8,113.5 R27.2 | v400.9,90.4 401.07,90.22 U7.12 | v456.7,112.3 457,112 R28.2
  Top 0.254: U13.B5 U13.C5 U13.D5 | U13.C2 U13.C1
  Top 0.3: v467,72.3 465.82,72.3 U8.8 | U8.14 C11.2 v458.3,70 | C12.2 v456.9,70 | v458.6,72.3 458.62,72.28 U8.9 U8.10 | v462.4,78.7 C25.2 | U16.8 388.2,115.78 v388.2,114.6 | v383.6,110.7 383.07,110.7 U19.8 | v383.6,108.1 C35.1 | v377.5,104.7 376.4,104.7 U15.4 | U17.4 383.6,104.72 v383.6,104.7 | U18.4 389.6,104.72 v389.6,104.8 | v376.9,113.4 377.5,114 C30.1 | C34.1 378.4,108.03 v378.4,107.4
  Top 0.5: 407.25,104.2 v408,104.2
  Bottom 0.3: C17.2 466.4,71.7 v467,72.3 | C16.2 v466.4,67.1 | C15.2 471.3,67.87 U10.PAD | U10.4 469.1,70.58 v469.1,71 | v464,75.4 U11.4 U11.3 | C18.2 462.37,71 v462.3,71
  other vias: 473.5,78.5 472,35 473,34 473,31.5 473,29.5 467,40 467,35.5 467,33.5 467,31.5 467,29.5 475,27.5 477,26.5 476,45 469,36 470,33.5 470,31.5 470,29.5 470,26 470,24 467,26 467,24 464,27.5 468,13 468,11 468,9 471,13 471,9 471,11 474,11 474,13 475,15 469,15 474,9 473,26 475,25 473,23 472,24 476,20 477,9 446,35.5 446,33.5 446,31.5 446,29.5 446,27.5 449,35.5 449,33.5 449,31.5 449,29.5 449,27.5 455,35.5 455,33.5 455,31.5 455,29.5 455,27.5 452,35.5 452,33.5 452,31.5 452,29.5 452,27.5 461,35.5 461,33.5 461,31.5 461,29.5 461,27.5 458,35.5 458,33.5 458,31.5 458,29.5 458,27.5 388,15 388,13 383,11 383,9 382,16 380,18 378,20 376,21 376,18 378,16 380,14 384,15 464,40 464,35.5 464,33.5 464,31.5 464,29.5 394,15 394,13 389,11 389,9 391,15 391,13 386,11 386,9 368,11 368,9 365,9 366,12 364,14 361,17 359,19 357,21 363,11 361,13 358,16 356,18 355,21 374,11 374,9 371,11 371,9 377,11 377,9 380,9 380,11 428,35.5 428,33.5 428,31.5 428,29.5 428,27.5 425,35.5 425,33.5 425,31.5 425,29.5 425,27.5 419,35.5 419,33.5 419,31.5 419,29.5 419,27.5 422,35.5 422,33.5 422,31.5 422,29.5 422,27.5 416,35.5 416,33.5 416,31.5 416,29.5 416,27.5 413,35.5 413,33.5 413,31.5 413,29.5 413,27.5 437,35.5 437,33.5 437,31.5 437,29.5 437,27.5 434,35.5 434,33.5 434,31.5 434,29.5 434,27.5 431,35.5 431,33.5 431,31.5 431,29.5 431,27.5 346.5,38 348,36.5 347,33.5 347,31.5 347,27.5 344,33.5 345.5,35 344,36.5 341,39.5 340.5,35 342,33.5 341,31.5 344,31.5 339,41.5 338.5,37 338.5,33 339,31.5 337,31.5 335,31.5 335,29.5 341,29.5 339,29.5 337,34.5 335.5,36 333,38 337,38.5 335,38.5 339,48 335,54 344,27 341,28 341,24 339,26 339,22 337,24 337,20 335,22 330,43.5 337,48 339,51 339,54 339,58 339,62 339,65 339,68 339,71 339,74 339,77 336,68 336,62 337,58 337,54 301,96 301,94 315.5,94.5 317.5,92.5 313,92.5 315,90.5 337,29.5 350,35.5 350,33.5 350,31.5 350,29.5 333,29.5 353,35.5 353,33.5 353,31.5 353,29.5 398,35.5 398,33.5 398,31.5 398,29.5 398,27.5 395,35.5 395,33.5 395,31.5 395,29.5 395,27.5 359,35.5 359,33.5 359,31.5 359,29.5 359,27.5 356,35.5 356,33.5 356,31.5 356,29.5 356,27.5 362,35.5 362,33.5 362,31.5 362,29.5 362,27.5 401,35.5 401,33.5 401,31.5 401,29.5 401,27.5 407,35.5 407,33.5 407,31.5 407,29.5 407,27.5 410,35.5 410,33.5 410,31.5 410,29.5 410,27.5 404,35.5 404,33.5 404,31.5 404,29.5 404,27.5 301,46 301,44 313,43 315,40.5 315,44.5 317,42.5 301,19 301,71 301,69 313,67.5 315,65.5 315,69.5 317,67.5 440,35.5 440,33.5 440,31.5 440,29.5 440,27.5 443,35.5 443,33.5 443,31.5 443,29.5 443,27.5 341,43.5 343,41.5 345,39.5 337,51 336,65 336,71 336,74 335,50 335,46 335,43 337,43 337,45 335,59 333,61 334,56 332,57.5 330,59.5 365,35.5 368,35.5 368,33.5 368,31.5 368,29.5 368,27.5 365,53 365,33.5 365,31.5 365,29.5 365,27.5 371,35.5 371,33.5 371,31.5 371,29.5 371,27.5 374,35.5 374,33.5 374,31.5 374,29.5 374,27.5 380,35.5 380,33.5 380,31.5 380,29.5 380,27.5 377,35.5 377,33.5 377,31.5 377,29.5 377,27.5 383,35.5 383,33.5 383,31.5 383,29.5 383,27.5 389,35.5 389,33.5 389,31.5 389,29.5 389,27.5 392,35.5 392,33.5 392,31.5 392,29.5 392,27.5 386,35.5 386,33.5 386,31.5 386,29.5 386,27.5 353,27.5 350,27.5 467,27.5 470,27.5 473,27.5 464,24 446,26 446,24 449,26 449,24 455,26 455,24 452,26 452,24 461,26 461,24 458,26 458,24 464,26 428,26 428,24 425,26 425,24 419,26 419,24 422,26 422,24 416,26 416,24 413,26 413,24 437,26 437,24 434,26 434,24 431,26 431,24 398,21 398,19 395,21 395,19 407,26 407,24 410,26 410,24 440,26 440,24 443,26 443,24 430,15 430,13 430,11 430,9 436,15 436,13 436,11 436,9 433,15 433,13 433,11 433,9 427,15 427,13 427,11 427,9 424,15 424,13 424,11 424,9 415,15 415,13 410,11 410,9 421,15 421,13 421,11 421,9 418,15 418,13 418,11 418,9 406,15 406,13 401,11 401,9 412,15 412,13 407,11 407,9 409,15 409,13 404,11 404,9 397,15 397,13 392,11 392,9 403,15 403,13 398,11 398,9 400,15 400,13 395,11 395,9 439,15 439,13 439,11 439,9 445,15 445,13 445,11 445,9 442,15 442,13 442,11 442,9 448,15 448,13 448,11 448,9 454,15 454,13 454,11 454,9 451,15 451,13 451,11 451,9 460,15 460,13 460,11 460,9 466,15 466,13 466,11 466,9 463,15 463,13 463,11 463,9 457,15 457,13 457,11 457,9 389,53 434,52 415,53 450.8,113.7 451.6,112.9 451.2,113.3 475.4,117.8 321.5,89.5 315.8,35.4 470.8,70.1 470.8,69.3 466.5,75.2 465.6,75.2 465.6,72.8 466.5,72.8 304,96 307,96 310,96 313,96 308,94 311,94 304,71 307,71 311,71 304,69 307,69 311,69 301,21 304,21 308,21 312,21 310,19 306,19 304,46 307,46 311,46 307,44 304,44 464.1,111.8 463.3,111.8 462.6,111.8 465.5,111.8 463,119 462.9,120.1 463,122.1 463,123.3 463,124.8 459.8,125 461.1,125 464.3,124.9 466,124.9 462,122.1 460.3,122 464,122.1 465.7,122 455.5,117.6 455.5,116.7 456.6,115.6 451.6,113.7 452.4,115.9 453.7,117.7 335,95 468,117 478.1,114.6 480.7,112 468.1,114.5 457.4,119.1 457.5,125 440.7,108 454.2,98.4 452.9,104.5 461.2,98.9 461.2,102.9 471.6,98.7 462.7,84.1 452.4,77.3 454.9,70.3 445.1,70 432.6,69.5 421.5,70.1 410.9,69.2 414.8,62.1 392.1,57.6 381.2,57 364.6,61.2 363.5,73.7 362.2,82.9 373.2,72.6 359.4,67 320.6,45.5 320.3,70.6 320.9,96.2 457.5,123 471,38 416,11 416,9 413,11 413,9 383,13 402,20 404,22 404,26 402,24 400,22 400,19 405,23 345,10 383.9,25.4 358.9,25.4 317.5,18.5 332,18.5 411.8,20 420.8,19 432.3,18.5 452.8,19.5 463.3,18.5 480.8,24.5 396.3,27 317,38.5 319,37.5 322,37.5 325,38 322,39.5 318.5,41 328.8,31.2 331,32.5 332.5,31.5 330.5,29.5 329.5,34 316.5,64 318,62.5 320.5,62.5 323,62.5 323.5,64.5 321,64.5 318.5,66 328,61.5 304.5,94 317,89 318.5,87.5 321.5,87.5 324.5,87.5 319,90.5 336,76 334,78 332.5,79.5 330.5,81.5 328.5,83.5 330,86 331.5,84.5 333,83 334,82 336,80 338,78 327.5,85 329,90.5 329,66 329,41 312,18 313.5,16 315,14.5 317,13.5 320,13.5 322.5,13.5 318,15.5 316.5,16.5 315,18.5 313.5,20 325,13.5 327.5,14 335.5,18.5 334,17 332.5,15.5 333.5,20.5 344,29.5 347,29.5 311,44 304,19 308,19 306,21 310,21 342.5,29.5 342.5,25.5 340,23 309,44 309,46 313.5,46 313.5,71 342.5,38 359.5,14.5 362.5,15.5 291,1 301,1 311,1 321,1 331,1 341,1 351,1 361,1 371,1 381,1 391,1 401,1 411,1 421,1 431,1 441,1 451,1 461,1 471,1 481,1 296,1 306,1 316,1 326,1 336,1 346,1 356,1 366,1 376,1 386,1 396,1 406,1 416,1 426,1 436,1 446,1 456,1 466,1 476,1 291,86 291,76 291,66 291,56 291,36 291,26 291,16 291,6 291,101 291,91 291,81 291,51 291,41 291,31 291,11 296,101 301,101 306,101 311,101 336,101 350,10 355,10 345,5 335,5 305,15 305,30 305,40 305,55 305,65 300,60 300,80 305,85 300,35 300,10 340,10 442.3,18.5 368.9,25.4 340,15 335,40.5 337,40.5 339,45.5 474,22 475,21 477,23 476,24 473,40 472,39 474,37 473,36 470,37 476,31 475,30 477,32 477,36 477,37 480,26 474,35 328.7,36.3 325.6,35.3 325.5,33.4 325.7,37.3 325.4,62.6 325.7,86.6 305,75 305,5 474.9,66.8 475.5,68.2 475.5,70.2 474.8,71.3 453.2,101.5 461.2,95 445.6,102.5 374.6,98.4 451,64.2 478.9,81.4 467.4,47.5 468.9,111.9 464.8,111.8 389.6,108.1 393.9,108.3
  pour Top: 338,102 291.8,102 290,100.2 290,-6 482,-6 482,52 468,52 454,38 352,38 340,50 340,100
  pour Top (rank 4): 368,132 368,116.2 361.8,110 358,106.2 358,56 364,50 442,50 458,66 475.5,66 475.5,51.5 482,51.5 482,132
  pour Bottom: 368,132 368,116.2 361.8,110 358,106.2 358,56 364,50 442,50 458,66 482,66 482,132
  pour Route15: 338,102 291.8,102 290,100.2 290,-6 482,-6 482,52 468,52 454,38 352,38 340,50 340,100
  pour Top (rank 3, no thermals): 467.2,111.4 459.1,111.4 459.1,125.9 467.3,125.9
HARP_CLKOUT  (via drill 0.2)
  Top 0.2: 402.63,105.37 U9.2 405.56,105.37 v405.6,105.4 | U5.8 457.37,108.9 445.2,108.9 v444.3,108
  Route15 0.2: v444.3,108 430.5,94.2 416.8,94.2 v405.6,105.4
I2C_SCL
  Top 0.2: 462.75,91.4 U5.19/A5 459.07,87.72 417.31,87.72 R10.2 408.96,96.08 U7.22
I2C_SDA
  Top 0.2: U5.18/A4 457.35,88.54 418.72,88.54 R11.2 409.66,96.72 U7.23
LRCLK
  Top 0.2: U12.14 450.95,111.35 451.3,111 467.97,111 U5.3
LVDS_DIN0_N1  (via drill 0.2)
  Top 0.2: J45.4 474.67,69.13 v474.7,69.1
  Bottom 0.2: v474.7,69.1 474.62,69.17 U10.7
LVDS_DIN0_P1  (via drill 0.2)
  Top 0.2: J45.17 v474.69,68.49 v474.7,68.5
  Bottom 0.2: v474.7,68.5 473.43,68.5 U10.8
LVDS_DIN1_N1  (via drill 0.2)
  Top 0.2: J45.16 472.84,69.8 v474.7,69.8
  Bottom 0.2: v474.7,69.8 474.68,69.83 U10.5
LVDS_DIN1_P1  (via drill 0.2)
  Top 0.2: 471.42,70.4 J45.3 474.6,70.4 v474.7,70.5
  Bottom 0.2: U10.6 473.43,70.5 v474.7,70.5
LVDS_DIN2_N
  Bottom 0.2: U11.7 468.27,73.6 469.1,73.6 469.5,74 469.5,74.55 469.76,74.8 469.76,74.81 470.01,75.06 SJ2.1
LVDS_DIN2_P
  Bottom 0.2: SJ1.1 470.03,73.03 U11.8
LVDS_DOUT0_N1
  Top 0.2: U8.1 467.54,67.72 R19.1 469.53,67.57 471.15,65.95 J45.19
LVDS_DOUT0_P1
  Top 0.2: U8.2 467.44,68.38 467.53,68.47 | 467.53,68.47 R19.2 | J45.6 471.01,66.59 469.1,68.5 467.57,68.5 467.53,68.47
LVDS_DOUT1_N1
  Top 0.2: J45.18 471.38,67.22 468.13,70.47 R20.1 466.57,71.6 466.4,71.6 465.82,71.6 U8.7
LVDS_DOUT1_P1  (via drill 0.2)
  Top 0.2: J45.5 472.58,68.07 471.19,68.07 467.74,71.53 R20.2 467.77,71.6 v468.4,71.6 | v466.82,70.72 466.56,70.97 U8.6
  Route2 0.2: v468.4,71.6 467.52,70.72 v466.82,70.72
LVDS_IN_1  (via drill 0.2)
  Top 0.2: U8.3 464.81,69.03 v464.61,69.22 | v389.5,111.2 389.52,111.17 U16.11 | U15.1 376.88,106.67 v377.4,107.2
  Route15 0.2: v464.61,69.22 464.57,69.22 462.8,71 462.8,71.6 459.05,75.35 459.05,88.05 462.4,91.4 462.4,101.17 463.73,102.5 U5.6 459.9,111.45 447.75,111.45 442.1,117.1 442.1,119.9 436.1,125.9 417.1,125.9 402.4,111.2 v389.5,111.2 386.9,111.2 385.7,110 379,110 377.4,108.4 v377.4,107.2
LVDS_IN_2  (via drill 0.2)
  Top 0.2: v464.57,70.33 U8.5 | U16.14 391.48,110.4 391.5,110.42 v391.5,112.2
  Route15 0.2: v464.57,70.33 464.57,73.12 461.3,76.4 461.3,84.6 467.6,90.9 467.6,100.97 466.27,102.3 U5.5 462.69,111.2 461.7,111.2 460,112.9 453.6,112.9 451.2,115.3 447.9,115.3 446.1,117.1 446.1,118.8 438.1,126.8 416.3,126.8 401.7,112.2 v391.5,112.2
LVDS_OUT_1  (via drill 0.2)
  Top 0.2: v383.1,114.4 383.07,114.42 U19.9
  Route15 0.2: v467.05,69.18 465.68,67.8 461.6,67.8 456.75,72.65 456.75,90.05 458.65,91.95 U5.17/A3 458.65,105.15 457.4,106.4 457.4,108.1 455.4,110.1 445.1,110.1 430,95 418.4,95 407.2,106.2 402.3,106.2 399.57,103.47 377.73,103.47 376.4,104.8 376.4,108.9 378.3,110.8 381.9,110.8 383.1,112 v383.1,114.4
  Bottom 0.2: U10.2 467.98,69.17 v467.06,69.17 v467.05,69.18
LVDS_OUT_2  (via drill 0.2)
  Top 0.2: v379.2,109.1 379.18,109.12 U19.2
  Route15 0.2: v467.8,69.6 467.43,69.6 467.33,69.7 466.5,69.7 465.3,68.5 463.8,68.5 460,72.3 459.99,72.3 457.9,74.4 457.9,88.5 459.9,90.5 459.9,104 461.19,105.29 U5.7 457.96,110.85 446.95,110.85 441.1,116.7 441.1,119.7 435.65,125.15 418,125.15 403.35,110.5 387.3,110.5 385.9,109.1 v379.2,109.1
  Bottom 0.2: U10.3 468.02,69.83 v467.8,69.6
LVDS_OUT_3  (via drill 0.2)
  Route15 0.2: v462.8,73.7 460.2,76.3 460.2,86.2 466.27,92.27 U5.20/A6
  Bottom 0.2: U11.2 462.82,73.67 v462.8,73.7
N$1
  Route2 0.48: J2.CLK 400,20 405,25 473,25 478,20 J1.SIG
N$2
  Route15 0.2: U6.1X1111 377.85,83 379.85,85 385.5,85 391.2,90.7 400.3,90.7 400.52,90.92 401.28,90.92 401.47,90.73 437.73,90.73 440.9,93.9 440.9,97 445.1,101.2 449.3,101.2 451.03,102.93 U5.11
N$3
  Route2 0.48: J4.CLK 376,20 382.05,13.95 475.95,13.95 477,15 J3.SIG
N$4
  Route2 0.48: J14.CLK 356,20 366,10 J13.SIG
N$5  (via drill 0.2)
  Top 0.2: D1.C U1.1 320.7,7 v320.8,7.1 | Q1.2 v327,17.3
  Bottom 0.2: v327,17.3 326.4,16.7 326.4,12.2 321.3,7.1 v320.8,7.1
N$6
  Route15 0.2: U6.1X1110 379.64,81 393.5,81 399.6,87.1 443.21,87.1 U5.13
N$7
  Route15 0.2: U6.1X119 374.71,79.81 374.71,83.17 384.67,93.13 408,93.13 408.93,92.2 431.5,92.2 448.2,108.9 452.29,108.9 U5.10
N$8  (via drill 0.35)
  Top 0.2: v380,83 379.4,82.4 379.4,75.68 U6.1X118
  Route15 0.2: v380,83 392.8,83 397.9,88.1 442.1,88.1 447.6,93.6 449.81,93.6 U5.14/A0
N$9
  Route15 0.2: U6.1X117 378.86,72.6 378.86,77.09 377.93,78.01 377.61,78.01 375.51,80.11 375.51,82.64 385.19,92.31 407.19,92.31 408.1,91.4 432.27,91.4 U5.12
N$10  (via drill 0.3, 0.5)
  Top 0.3: U12.10 449.62,113.63 449.19,113.63 448.9,113.92 v448.9,115.9
  Top 0.5: L2.2 455.5,125.72 455.5,119.7 v454.4,118.6
  Route15 0.5: v454.4,118.6 449.6,118.6 448.9,117.9 v448.9,115.9
N$11  (via drill 0.2)
  Top 0.2: v470.8,74.9 470.8,72.2 471.33,71.67 J45.2
  Bottom 0.2: v470.8,74.9 470.4,74.5 SJ2.COM
N$12  (via drill 0.2)
  Top 0.2: J45.15 472.77,71 v471,71
  Bottom 0.2: v471,71 470.1,71 469.66,71.44 469.66,71.94 469.76,72.04 469.76,72.05 469.89,72.18 470.08,72.18 SJ1.COM
N$13
  Top 0.2: R25.2 466.8,79.13 U14.8
N$14
  Top 0.3: U12.9 449.7,115.3
  Top 0.5: 449.7,115.3 449.7,118.9 450.1,119.3 452.4,119.3 454.02,120.92 L1.2
N$15
  Top 0.2: C5.2 322.03,17.17 U1.6
N$16
  Top 0.2: J43.1 402.2,118.83 402.2,113.7 401.4,112.9 401.4,105.9 399.6,104.09 U9.8 398.05,104 396.47,104 C13.1
N$17
  Top 0.2: 395,106.5 C13.2 396.37,107.91 U9.5 398.15,124.02 J43.5
N$18
  Top 0.2: J43.4 400.3,116.78 400.3,107.6 399.4,106.7 397.6,106.7 397.66,106.63 U9.6
N$19  (via drill 0.5)
  Top 0.48: U2.5 327.5,40.9 v327.5,39.5
  Route2 0.48: J10.SIG 478,35 | v327.5,39.5 327.5,34 331,30.5 473,30.5
  Route2 0.5: 478,35 473.5,30.5 473,30.5
N$20
  Top 0.2: U15.2 U15.3
N$21
  Top 0.2: U17.1 381.48,106.67 381.1,106.3 381.1,105.7 380.77,105.38 U15.5
N$22
  Top 0.2: R6.1 C6.1
N$23
  Top 0.2: R1.1 323.47,23.27 S1.1
N$24
  Top 0.2: U13.A4 R29.1
N$25
  Top 0.2: U13.E4 458.53,113.73 R27.1
N$26
  Top 0.2: U13.A3 466.94,113.6 C27.2
N$27
  Top 0.2: U13.E3 C28.2
N$28  (via drill 0.5)
  Top 0.48: v329,16 U1.5
  Route2 0.48: 474,28.5 343.5,28.5 331,16 v329,16 | J9.SIG 478,30
  Route2 0.5: 478,30 476.5,28.5 474,28.5
N$29  (via drill 0.5)
  Top 0.48: U1.1X6 325.4,15.5 v324.4,14.5
  Route2 0.48: v324.4,14.5 317,14.5 311.5,20 J5.CLK
N$30
  Top 0.2: C5.1 R5.1
N$31
  Top 0.2: C6.2 321.53,42.67 U2.6
N$32  (via drill 0.2)
  Top 0.2: D3.C U3.1 321.2,57 v321.5,57.3 | Q3.2 326.46,67.3 v325.1,67.3
  Bottom 0.2: v325.1,67.3 321.5,63.7 v321.5,57.3
N$33
  Top 0.2: R7.1 C7.1
N$34  (via drill 0.5)
  Top 0.48: v325,39.5 325.4,39.9 U2.1X6
  Route2 0.48: v325,39.5 324,38.5 319,38.5 312.5,45 J6.CLK
N$35
  Top 0.2: S2.1 322.97,47.77 R2.2
N$36
  Top 0.2: U3.6 321.53,67.67 C7.2
N$37  (via drill 0.5)
  Top 0.48: U3.5 327.5,65.9 v327.5,64.5
  Route2 0.48: 473,32.5 341,32.5 336,37.5 336,55.5 327.5,64 v327.5,64.5 | 478,40 J11.SIG
  Route2 0.5: 473,32.5 476,35.5 476,38 478,40
N$38
  Top 0.2: S3.1 322.97,72.77 R3.2
N$39  (via drill 0.2)
  Top 0.2: D4.C U4.1 320.5,82 v320.9,82.4 | Q4.2 326.46,92.3 v325.5,92.3
  Bottom 0.2: v325.5,92.3 322.7,89.5 322.7,84.2 v320.9,82.4
N$40  (via drill 0.2)
  Top 0.2: D2.C U2.1 320.7,32 v320.8,32.1 | Q2.2 326.36,42.2 325.5,42.2 v325.5,42.23
  Bottom 0.2: v325.5,42.23 321,37.73 321,32.3 v320.8,32.1
N$41
  Top 0.2: 468.4,75.7 C26.1 | 468.4,75.7 467.75,75.7 U14.5 | 468.4,75.7 469.53,76.83 R26.1 R24.1
N$42
  Top 0.2: 400.35,97.38 R9.2 400.36,97.38 U7.1 402.3,97.38
N$43  (via drill 0.5)
  Top 0.48: v325,64.5 325.4,64.9 U3.1X6
  Route2 0.48: J7.CLK 312.5,70 319,63.5 324,63.5 v325,64.5
N$44
  Top 0.2: S4.1 323.47,98.27 R4.2
N$45
  Top 0.2: R8.1 C8.1
N$46
  Top 0.2: U4.6 322.03,92.17 C8.2
N$47  (via drill 0.5)
  Top 0.48: U4.5 v327.6,89
  Route2 0.48: 468,34.5 348,34.5 338,44.5 338,76 327.6,86.4 v327.6,89 | 479.1,45 J12.SIG
  Route2 0.5: 468,34.5 469.82,34.5 475.85,40.53 475.85,42.85 478,45 479.1,45
N$48  (via drill 0.5)
  Top 0.48: v325,89 325.4,89.4 U4.1X6
  Route2 0.48: J8.CLK 312.5,95 319,88.5 324.5,88.5 v325,89
N$49
  Top 0.2: U17.2 U17.3
N$50
  Top 0.2: U18.1 387.38,106.67 387.1,106.4 387.1,105.7 386.77,105.38 U17.5
N$51
  Top 0.2: U18.2 U18.3
N$145
  Top 0.2: R28.1 459.67,113.13 462.4,113.13 U13.C4
RELAY_SENSE_1  (via drill 0.2)
  Top 0.2: R1.2 325.18,17.85 Q1.1 326.64,18.5 C1.2 329,18.54 v329,20 | U7.7 397.48,93.47 395.1,91.1 v358.7,91.1
  Bottom 0.2: v329,20 334,20 336.1,22.1 336.1,60.6 337,61.5 337,80 348.1,91.1 v358.7,91.1
RELAY_SENSE_2  (via drill 0.2)
  Top 0.2: R2.1 324.68,42.85 Q2.1 326.64,43.5 C2.2 329,43.5 v329,45 | U7.6 396.12,94.12 394.1,92.1 v358.7,92.1
  Bottom 0.2: v329,45 333,45 334.48,46.48 334.48,67 335.42,67.94 335.42,86.92 338.7,90.2 340.5,92 340.6,92.1 v358.7,92.1
RELAY_SENSE_3  (via drill 0.2)
  Top 0.2: R3.1 324.68,67.85 Q3.1 326.64,68.5 C3.2 329,68.5 v329,70 | U7.5 394.77,94.78 393.1,93.1 v358.7,93.1
  Bottom 0.2: v329,70 334,70 334.5,70.5 334.5,87.5 338.7,91.7 340,93 340.1,93.1 v358.7,93.1
RELAY_SENSE_4  (via drill 0.2)
  Top 0.2: R4.1 325.18,92.85 Q4.1 326.64,93.5 C4.2 v330,93.5 | U7.4 393.43,95.42 392.1,94.1 v358.7,94.1
  Bottom 0.2: v330,93.5 338.5,93.5 339.1,94.1 v358.7,94.1
SD_MODE
  Top 0.2: R23.1 453.28,114.05 U12.4
SH/!LH  (via drill 0.2)
  Top 0.2: U19.1 378.52,111.41 | 378.52,111.41 378.52,111.42 | 378.52,111.41 378.52,111.8 v378.5,111.8
  Route15 0.2: U5.9 454.23,109.5 447.3,109.5 430.8,93 413.5,93 412.75,93.75 386.25,93.75 375.5,104.5 375.5,110.2 377.1,111.8 v378.5,111.8
VO+
  Top 0.5: 440.17,116.8 J44.4 | 448.12,122.12 447.78,122.45 447.78,124.09 J44.1 | 448.12,122.12 C22.1 448.33,121.9 L1.1 | J44.4 442.27,114.95 J46.2 | 448.12,122.12 445.61,122.12 441.26,117.77 441.26,117.64 J44.4
VO-  (via drill 0.5)
  Top 0.5: L2.1 448.4,127.2 C19.1 441.39,127.17 J44.5 439.7,125.47 v439.7,119 | v439.7,105.8 439.73,105.77 J46.1
  Route15 0.5: v439.7,119 v439.7,105.8

## Text on the board
tPlace: +3.3V | +5V | GND | +12V | HS 3 | AIO 0 | AIO 2 | AIO 4 | AIO 6 | AIO 8 | AIO 10 | HS 2 | GND | AGND | AGND | HS 1 | AIO 1 | AIO 3 | AIO 5 | AIO 7 | AIO 9 | AIO 11 | HS 0 | CLK 0 | CLK 1 | CLK 2 | GND | GND
tDocu: thin case | tall case